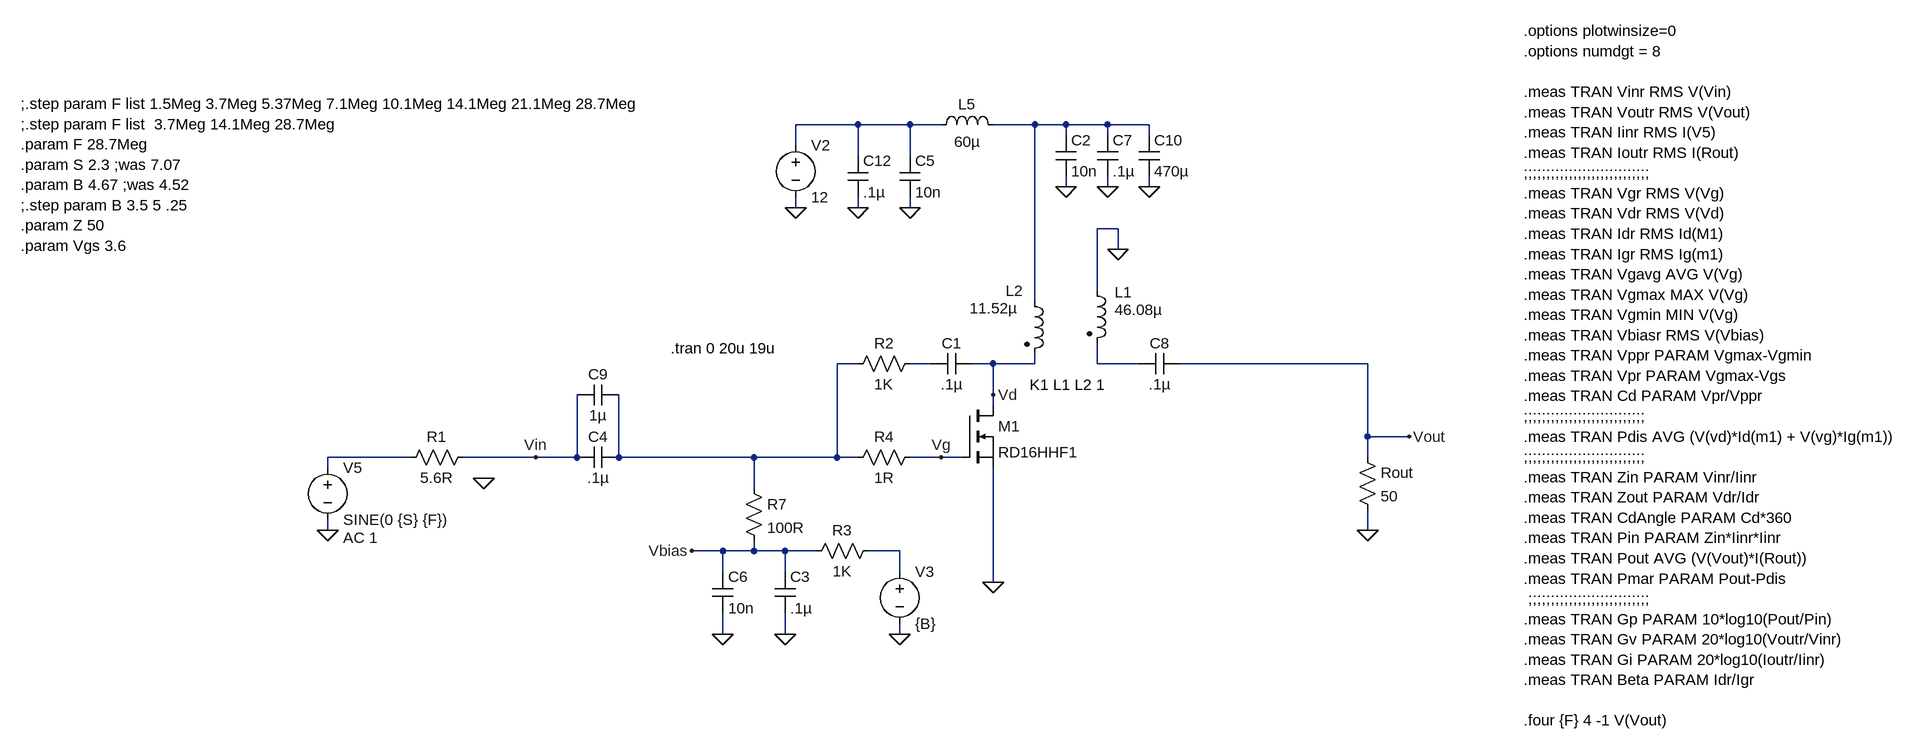
[diagram p0: schematic Genesis PA RD16HHF Power Amp Testing.asc]
Genesis PA RD16HHF Power Amp Testing.asc, the LTspice schematic file:
Version 4
SHEET 1 3060 1616
WIRE 1136 -416 1040 -416
WIRE 1216 -416 1136 -416
WIRE 1264 -416 1216 -416
WIRE 1408 -416 1344 -416
WIRE 1456 -416 1408 -416
WIRE 1520 -416 1456 -416
WIRE 1584 -416 1520 -416
WIRE 1456 -400 1456 -416
WIRE 1520 -400 1520 -416
WIRE 1584 -400 1584 -416
WIRE 1040 -384 1040 -416
WIRE 1136 -368 1136 -416
WIRE 1216 -368 1216 -416
WIRE 1456 -320 1456 -336
WIRE 1520 -320 1520 -336
WIRE 1584 -320 1584 -336
WIRE 1040 -288 1040 -304
WIRE 1136 -288 1136 -304
WIRE 1216 -288 1216 -304
WIRE 1536 -256 1504 -256
WIRE 1536 -224 1536 -256
WIRE 1504 -160 1504 -256
WIRE 1408 -144 1408 -416
WIRE 1136 -48 1104 -48
WIRE 1248 -48 1216 -48
WIRE 1344 -48 1312 -48
WIRE 1408 -48 1408 -64
WIRE 1408 -48 1344 -48
WIRE 1504 -48 1504 -80
WIRE 1568 -48 1504 -48
WIRE 1920 -48 1632 -48
WIRE 1344 0 1344 -48
WIRE 1344 16 1344 0
WIRE 1920 64 1920 -48
WIRE 1984 64 1920 64
WIRE 448 96 320 96
WIRE 640 96 528 96
WIRE 704 96 704 0
WIRE 704 96 640 96
WIRE 768 96 768 0
WIRE 976 96 768 96
WIRE 1104 96 1104 -48
WIRE 1104 96 976 96
WIRE 1136 96 1104 96
WIRE 1264 96 1216 96
WIRE 1296 96 1264 96
WIRE 1920 96 1920 64
WIRE 320 112 320 96
WIRE 976 144 976 96
WIRE 320 208 320 192
WIRE 1920 208 1920 176
WIRE 928 240 880 240
WIRE 976 240 976 224
WIRE 976 240 928 240
WIRE 1024 240 976 240
WIRE 1072 240 1024 240
WIRE 1200 240 1152 240
WIRE 928 272 928 240
WIRE 1024 272 1024 240
WIRE 1200 272 1200 240
WIRE 1344 288 1344 112
WIRE 928 368 928 336
WIRE 1024 368 1024 336
WIRE 1200 368 1200 352
FLAG 1040 -288 0
FLAG 1200 368 0
FLAG 1344 288 0
FLAG 1216 -288 0
FLAG 1520 -320 0
FLAG 1456 -320 0
FLAG 1136 -288 0
FLAG 1920 208 0
FLAG 1984 64 Vout
FLAG 1264 96 Vg
FLAG 1344 0 Vd
FLAG 320 208 0
FLAG 1024 368 0
FLAG 640 96 Vin
FLAG 880 240 Vbias
FLAG 1536 -224 0
FLAG 928 368 0
FLAG 1584 -320 0
FLAG 560 128 0
SYMBOL voltage 1040 -400 R0
WINDOW 123 0 0 Left 2
WINDOW 39 0 0 Left 2
SYMATTR InstName V2
SYMATTR Value 12
SYMBOL cap 768 80 R90
WINDOW 0 0 32 VBottom 2
WINDOW 3 32 32 VTop 2
SYMATTR InstName C4
SYMATTR Value .1µ
SYMBOL voltage 1200 256 R0
WINDOW 123 0 0 Left 2
WINDOW 39 0 0 Left 2
SYMATTR InstName V3
SYMATTR Value {B}
SYMBOL res 960 128 R0
SYMATTR InstName R7
SYMATTR Value 100R
SYMBOL ind 1248 -400 R270
WINDOW 0 32 56 VTop 2
WINDOW 3 5 56 VBottom 2
SYMATTR InstName L5
SYMATTR Value 60µ
SYMBOL cap 1200 -368 R0
SYMATTR InstName C5
SYMATTR Value 10n
SYMBOL cap 1504 -400 R0
SYMATTR InstName C7
SYMATTR Value .1µ
SYMBOL cap 1568 -32 R270
WINDOW 0 32 32 VTop 2
WINDOW 3 0 32 VBottom 2
SYMATTR InstName C8
SYMATTR Value .1µ
SYMBOL cap 1440 -400 R0
SYMATTR InstName C2
SYMATTR Value 10n
SYMBOL cap 1120 -368 R0
SYMATTR InstName C12
SYMATTR Value .1µ
SYMBOL res 1904 80 R0
SYMATTR InstName Rout
SYMATTR Value 50
SYMBOL voltage 320 96 R0
WINDOW 123 24 124 Left 2
WINDOW 39 24 152 Left 2
SYMATTR Value2 AC 1
SYMATTR InstName V5
SYMATTR Value SINE(0 {S} {F})
SYMBOL nmos 1296 16 R0
SYMATTR InstName M1
SYMATTR Value RD16HHF1
SYMBOL cap 1008 272 R0
SYMATTR InstName C3
SYMATTR Value .1µ
SYMBOL ind2 1488 -176 R0
WINDOW 0 43 18 Left 2
WINDOW 3 43 45 Left 2
SYMATTR InstName L1
SYMATTR Value 46.08µ
SYMATTR Type ind
SYMBOL ind2 1392 -160 R0
WINDOW 0 -29 0 Left 2
WINDOW 3 -84 27 Left 2
SYMATTR InstName L2
SYMATTR Value 11.52µ
SYMATTR Type ind
SYMBOL res 544 80 R90
WINDOW 0 0 56 VBottom 2
WINDOW 3 32 56 VTop 2
SYMATTR InstName R1
SYMATTR Value 5.6R
SYMBOL cap 1312 -64 R90
WINDOW 0 0 32 VBottom 2
WINDOW 3 32 32 VTop 2
SYMATTR InstName C1
SYMATTR Value .1µ
SYMBOL res 1232 -64 R90
WINDOW 0 0 56 VBottom 2
WINDOW 3 32 56 VTop 2
SYMATTR InstName R2
SYMATTR Value 1K
SYMBOL cap 912 272 R0
SYMATTR InstName C6
SYMATTR Value 10n
SYMBOL res 1168 224 R90
WINDOW 0 0 56 VBottom 2
WINDOW 3 32 56 VTop 2
SYMATTR InstName R3
SYMATTR Value 1K
SYMBOL res 1232 80 R90
WINDOW 0 0 56 VBottom 2
WINDOW 3 32 56 VTop 2
SYMATTR InstName R4
SYMATTR Value 1R
SYMBOL cap 768 -16 R90
WINDOW 0 0 32 VBottom 2
WINDOW 3 32 32 VTop 2
SYMATTR InstName C9
SYMATTR Value 1µ
SYMBOL cap 1568 -400 R0
SYMATTR InstName C10
SYMATTR Value 470µ
TEXT 848 -72 Left 2 !.tran 0 20u 19u
TEXT 2160 -560 Left 2 !.options plotwinsize=0\n.options numdgt = 8\n \n.meas TRAN Vinr RMS V(Vin)\n.meas TRAN Voutr RMS V(Vout)\n.meas TRAN Iinr RMS I(V5)\n.meas TRAN Ioutr RMS I(Rout)\n;;;;;;;;;;;;;;;;;;;;;;;;;;;;\n.meas TRAN Vgr RMS V(Vg)\n.meas TRAN Vdr RMS V(Vd)\n.meas TRAN Idr RMS Id(M1)\n.meas TRAN Igr RMS Ig(m1)\n.meas TRAN Vgavg AVG V(Vg)\n.meas TRAN Vgmax MAX V(Vg)\n.meas TRAN Vgmin MIN V(Vg)\n.meas TRAN Vbiasr RMS V(Vbias)\n.meas TRAN Vppr PARAM Vgmax-Vgmin\n.meas TRAN Vpr PARAM Vgmax-Vgs\n.meas TRAN Cd PARAM Vpr/Vppr\n;;;;;;;;;;;;;;;;;;;;;;;;;;;\n.meas TRAN Pdis AVG (V(vd)*Id(m1) + V(vg)*Ig(m1))\n;;;;;;;;;;;;;;;;;;;;;;;;;;;\n.meas TRAN Zin PARAM Vinr/Iinr\n.meas TRAN Zout PARAM Vdr/Idr\n.meas TRAN CdAngle PARAM Cd*360\n.meas TRAN Pin PARAM Zin*Iinr*Iinr\n.meas TRAN Pout AVG (V(Vout)*I(Rout))\n.meas TRAN Pmar PARAM Pout-Pdis\n ;;;;;;;;;;;;;;;;;;;;;;;;;;;\n.meas TRAN Gp PARAM 10*log10(Pout/Pin)\n.meas TRAN Gv PARAM 20*log10(Voutr/Vinr)\n.meas TRAN Gi PARAM 20*log10(Ioutr/Iinr)\n.meas TRAN Beta PARAM Idr/Igr\n \n.four {F} 4 -1 V(Vout)
TEXT -152 -448 Left 2 !;.step param F list 1.5Meg 3.7Meg 5.37Meg 7.1Meg 10.1Meg 14.1Meg 21.1Meg 28.7Meg\n;.step param F list  3.7Meg 14.1Meg 28.7Meg\n.param F 28.7Meg\n.param S 2.3 ;was 7.07\n.param B 4.67 ;was 4.52\n;.step param B 3.5 5 .25\n.param Z 50\n.param Vgs 3.6
TEXT 1400 -16 Left 2 !K1 L1 L2 1

The netlist it stands for:
* Genesis PA RD16HHF Power Amp Testing.asc
V2 N001 0 12
C4 N003 Vin .1µ
V3 N007 0 {B}
R7 N003 Vbias 100R
L5 N001 N002 60µ
C5 N001 0 10n
C7 N002 0 .1µ
C8 N005 Vout .1µ
C2 N002 0 10n
C12 N001 0 .1µ
Rout Vout 0 50
V5 N006 0 SINE(0 {S} {F}) AC 1
M1 Vd Vg 0 0 RD16HHF1
C3 Vbias 0 .1µ
L1 0 N005 46.08µ
L2 N002 Vd 11.52µ
R1 Vin N006 5.6R
C1 Vd N004 .1µ
R2 N004 N003 1K
C6 Vbias 0 10n
R3 N007 Vbias 1K
R4 Vg N003 1R
C9 N003 Vin 1µ
C10 N002 0 470µ
.model NMOS NMOS
.model PMOS PMOS
.lib standard.mos
.tran 0 20u 19u
.options plotwinsize=0
.options numdgt = 8
.meas TRAN Vinr RMS V(Vin)
.meas TRAN Voutr RMS V(Vout)
.meas TRAN Iinr RMS I(V5)
.meas TRAN Ioutr RMS I(Rout)
;;;;;;;;;;;;;;;;;;;;;;;;;;;;
.meas TRAN Vgr RMS V(Vg)
.meas TRAN Vdr RMS V(Vd)
.meas TRAN Idr RMS Id(M1)
.meas TRAN Igr RMS Ig(m1)
.meas TRAN Vgavg AVG V(Vg)
.meas TRAN Vgmax MAX V(Vg)
.meas TRAN Vgmin MIN V(Vg)
.meas TRAN Vbiasr RMS V(Vbias)
.meas TRAN Vppr PARAM Vgmax-Vgmin
.meas TRAN Vpr PARAM Vgmax-Vgs
.meas TRAN Cd PARAM Vpr/Vppr
;;;;;;;;;;;;;;;;;;;;;;;;;;;
.meas TRAN Pdis AVG (V(vd)*Id(m1) + V(vg)*Ig(m1))
;;;;;;;;;;;;;;;;;;;;;;;;;;;
.meas TRAN Zin PARAM Vinr/Iinr
.meas TRAN Zout PARAM Vdr/Idr
.meas TRAN CdAngle PARAM Cd*360
.meas TRAN Pin PARAM Zin*Iinr*Iinr
.meas TRAN Pout AVG (V(Vout)*I(Rout))
.meas TRAN Pmar PARAM Pout-Pdis
 ;;;;;;;;;;;;;;;;;;;;;;;;;;;
.meas TRAN Gp PARAM 10*log10(Pout/Pin)
.meas TRAN Gv PARAM 20*log10(Voutr/Vinr)
.meas TRAN Gi PARAM 20*log10(Ioutr/Iinr)
.meas TRAN Beta PARAM Idr/Igr
.four {F} 4 -1 V(Vout)
;.step param F list 1.5Meg 3.7Meg 5.37Meg 7.1Meg 10.1Meg 14.1Meg 21.1Meg 28.7Meg
;.step param F list  3.7Meg 14.1Meg 28.7Meg
.param F 28.7Meg
.param S 2.3 ;was 7.07
.param B 4.67 ;was 4.52
;.step param B 3.5 5 .25
.param Z 50
.param Vgs 3.6
K1 L1 L2 1
.backanno
.end